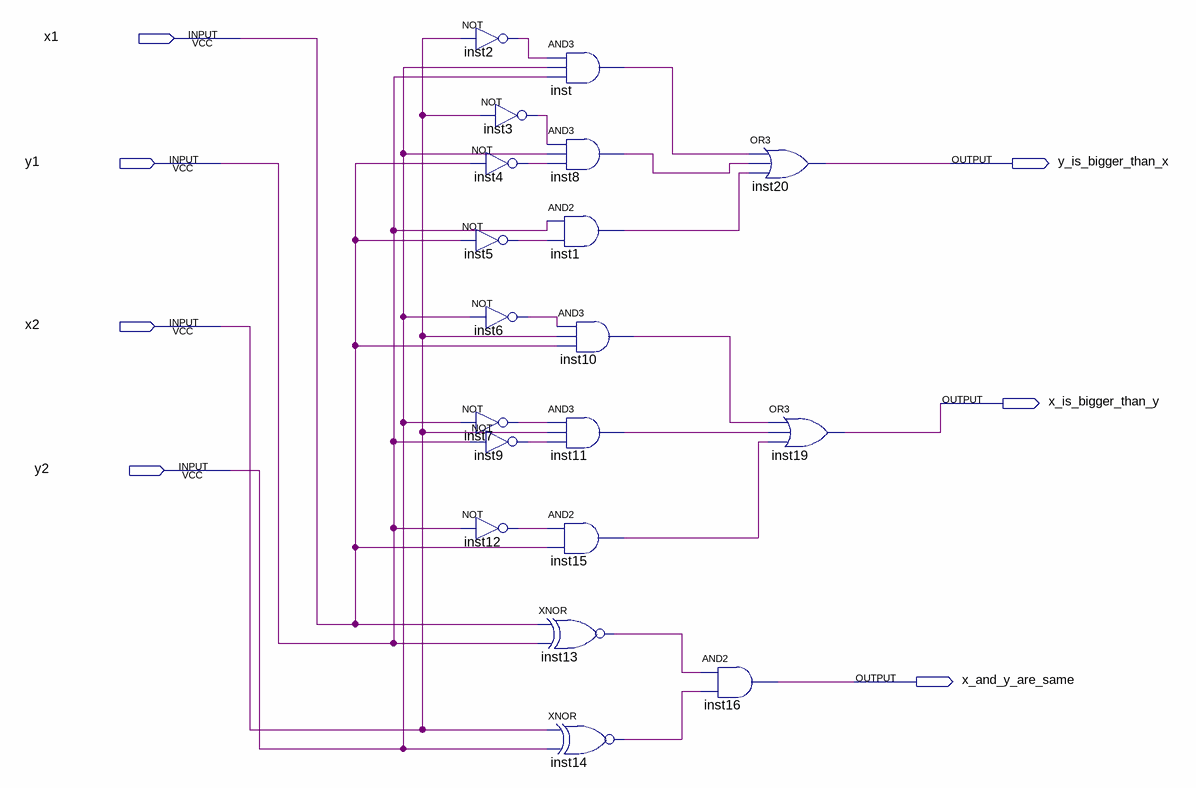
[diagram p0: schematic sheet]
// Quartus schematic lab3_1_2.bdf as structural Verilog: 19 symbols, 7 pins
module lab3_1_2 (
  input  x1,
  input  y1,
  input  x2,
  input  y2,
  output y_is_bigger_than_x,
  output x_is_bigger_than_y,
  output x_and_y_are_same
);

  wire inst1_out, inst2_out, inst3_out, inst4_out, inst5_out, inst6_out, inst7_out, inst8_out, inst9_out,
       inst10_out, inst11_out, inst12_out, inst13_out, inst14_out, inst15_out, inst_out;

  not inst2 (inst2_out, x2);
  not inst5 (inst5_out, x1);
  not inst7 (inst7_out, y2);
  not inst12 (inst12_out, y1);
  not inst3 (inst3_out, x2);
  not inst4 (inst4_out, x1);
  not inst6 (inst6_out, y2);
  not inst9 (inst9_out, y1);
  xnor inst13 (inst13_out, x1, y1);
  and inst (inst_out, inst2_out, y2, y1);
  and inst8 (inst8_out, inst3_out, y2, inst4_out);
  and inst1 (inst1_out, y1, inst5_out);
  and inst10 (inst10_out, inst6_out, x2, x1);
  and inst11 (inst11_out, inst7_out, x2, inst9_out);
  and inst15 (inst15_out, inst12_out, x1);
  xnor inst14 (inst14_out, x2, y2);
  or inst20 (y_is_bigger_than_x, inst_out, inst8_out, inst1_out);
  or inst19 (x_is_bigger_than_y, inst10_out, inst11_out, inst15_out);
  and inst16 (x_and_y_are_same, inst13_out, inst14_out);
endmodule
